# EAGLE design PulseDetector (EAGLE 7.2.0)
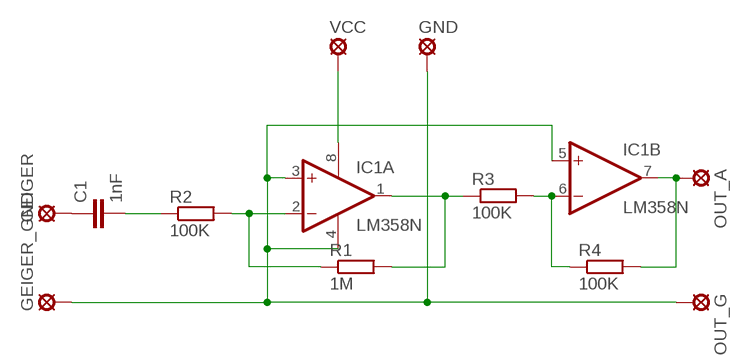
[diagram p0: schematic, sheet 1]

## Parts
C1  1nF  C-EU025-025X050  [C025-025X050]
GEIGER  LSP10  [LSP10]
GEIGER_GND  LSP10  [LSP10]
GND  LSP10  [LSP10]
IC1  LM358N  [DIL08]
OUT_A  LSP10  [LSP10]
OUT_G  LSP10  [LSP10]
R1  1M  R-EU_0207/10  [0207/10]
R2  100K  R-EU_0207/10  [0207/10]
R3  100K  R-EU_0207/10  [0207/10]
R4  100K  R-EU_0207/10  [0207/10]
VCC  LSP10  [LSP10]

## Nets
N$1: IC1.2(A:-IN) R1.1 R2.2
N$2: GEIGER_GND.MP GND.MP IC1.3(A:+IN) IC1.4(P:V-) IC1.5(B:+IN) OUT_G.MP
N$3: IC1.1(A:OUT) R1.2 R3.1
N$4: IC1.6(B:-IN) R3.2 R4.1
N$5: C1.2 R2.1
N$6: IC1.8(P:V+) VCC.MP
N$7: IC1.7(B:OUT) OUT_A.MP R4.2
N$8: C1.1 GEIGER.MP

## Library data of the parts
C1 = rcl:C-EU: CAPACITOR, European symbol
GEIGER GEIGER_GND GND OUT_A OUT_G VCC = solpad:LSP10: SOLDER PAD drill 1.0 mm, distributor Buerklin, 12H555
IC1 = linear:LM358: OP AMP also LM158; LM258; LM2904 Source: http://cache.national.com/ds/LM/LM158.pdf
R1-R4 = rcl:R-EU_: RESISTOR, European symbol

## Board
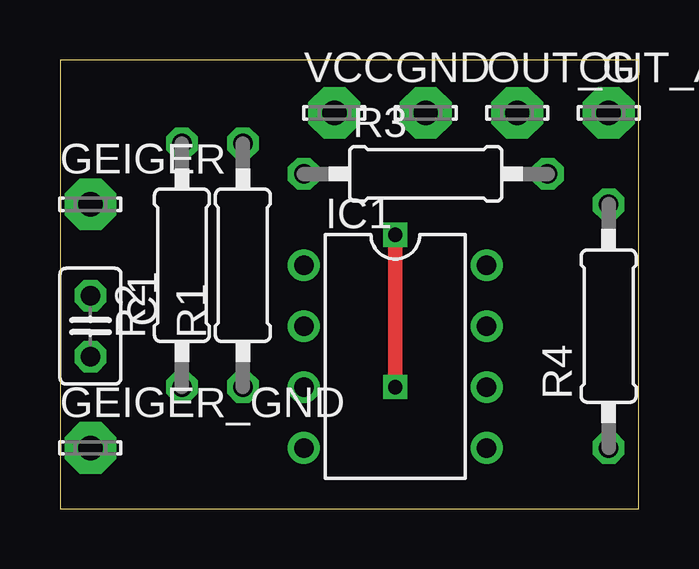
[diagram p1: board, top side]
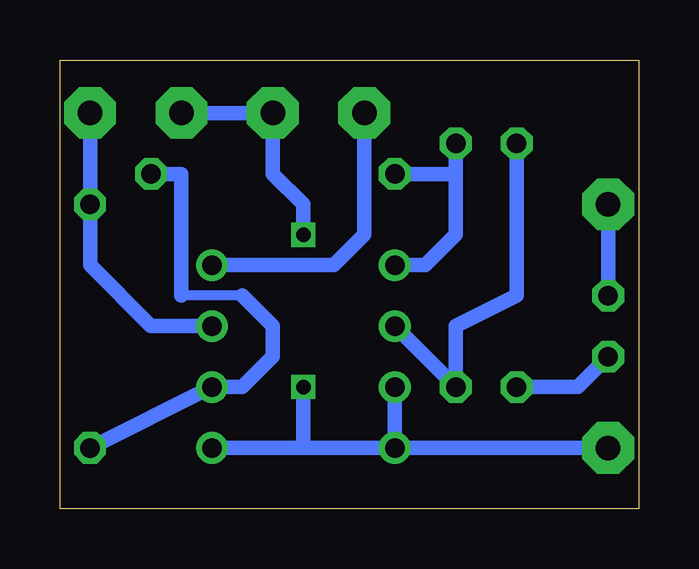
[diagram p2: board, bottom side, seen from below]

Size 24.11 x 18.72 mm. Coordinates in mm from the lower left corner, seen from the top.
Outline: 0,0 24.11,0 24.11,18.72 0,18.72 0,0
Copper layers (1*16): Top 0.035mm / dielectric 1.5mm / Bottom 0.035mm
Design rules "default": minimum track width 10mil, minimum drill 24mil, track to track 8mil, track to pad 8mil, pad to pad 8mil, via to via 8mil, smd to smd 8mil, copper to edge 40mil, drill to drill 8mil, minimum pad ring 10mil, minimum via ring 8mil, stop-mask expansion 4mil, vias tented up to drill 0mil, thermal gap 10mil

### Footprints (pad centres in the part's own frame; a part is rotated, then mirrored left to right if it is on the bottom)
C025-025X050 = drill 0.813 octagon: 1 -1.27,0; 2 1.27,0
LSP10 = drill 1.016 pad 2.159 octagon: MP 0,0
DIL08 = drill 0.813 pad 1.27: 1 -3.81,-3.81; 2 -1.27,-3.81; 3 1.27,-3.81; 4 3.81,-3.81; 5 3.81,3.81; 6 1.27,3.81; 7 -1.27,3.81; 8 -3.81,3.81
0207/10 = drill 0.813 octagon: 1 -5.08,0; 2 5.08,0

### Placement (x,y rotation side)
C1  1.27,7.62 270 top
GEIGER  1.27,12.7 0 top
GEIGER_GND  1.27,2.54 0 top
GND  15.24,16.51 0 top
IC1  13.97,6.35 270 top
OUT_A  22.86,16.51 0 top
OUT_G  19.05,16.51 0 top
R1  7.62,10.16 90 top
R2  5.08,10.16 90 top
R3  15.24,13.97 0 top
R4  22.86,7.62 90 top
VCC  11.43,16.51 0 top

### Tracks (layer width: path | path; a pad name or v marks a point on that pad's centre or on a via)
N$1
  Bottom 0.61: R2.2 5.08,8.89 7.62,7.62 R1.1 IC1.2
N$2  (via drill 0.6)
  Top 0.61: v13.97,11.43 v13.97,5.08
  Bottom 0.61: GEIGER_GND.MP IC1.4 | IC1.4 IC1.3 | IC1.4 13.97,2.54 | 13.97,2.54 IC1.5 | v13.97,11.43 13.97,12.7 15.24,13.97 GND.MP OUT_G.MP | 13.97,2.54 v13.97,5.08
N$3
  Bottom 0.61: R1.2 7.62,13.97 | 7.62,13.97 7.62,11.43 8.89,10.16 IC1.1 | R3.1 7.62,13.97
N$4
  Bottom 0.406: 16.51,8.89 19.05,8.89
  Bottom 0.61: R4.1 IC1.6 16.51,5.08 15.24,6.35 15.24,7.62 16.51,8.89 | 19.05,8.89 19.05,13.97 R3.2
N$5
  Bottom 0.61: C1.2 2.54,5.08 R2.1
N$6
  Bottom 0.61: VCC.MP 11.43,11.43 12.7,10.16 IC1.8
N$7
  Bottom 0.61: OUT_A.MP R4.2 22.86,10.16 20.32,7.62 IC1.7
N$8
  Bottom 0.61: GEIGER.MP C1.1